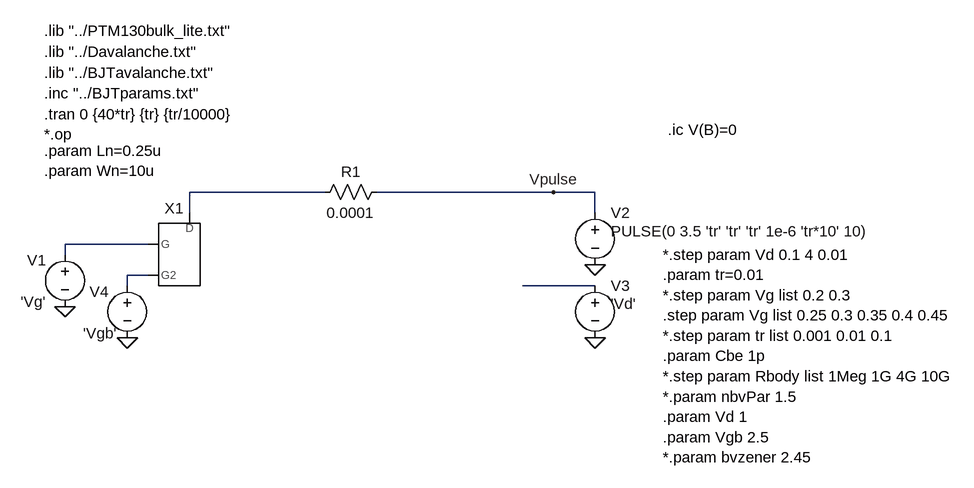
[diagram p0: schematic SubC_SimpleTest.asc]
SubC_SimpleTest.asc, the LTspice schematic file:
Version 4
SHEET 1 2588 680
WIRE 608 48 400 48
WIRE 960 48 688 48
WIRE 1024 48 960 48
WIRE 400 80 400 48
WIRE 1024 80 1024 48
WIRE 336 128 208 128
WIRE 208 144 208 128
WIRE 336 176 304 176
WIRE 304 192 304 176
WIRE 1024 192 912 192
FLAG 208 224 0
FLAG 960 48 Vpulse
FLAG 1024 272 0
FLAG 1024 160 0
FLAG 304 272 0
SYMBOL voltage 208 128 R0
WINDOW 123 0 0 Left 0
WINDOW 39 0 0 Left 0
WINDOW 0 -58 25 Left 2
WINDOW 3 -68 89 Left 2
SYMATTR InstName V1
SYMATTR Value 'Vg'
SYMBOL voltage 1024 64 R0
WINDOW 3 24 44 Left 2
WINDOW 123 0 0 Left 0
WINDOW 39 0 0 Left 0
SYMATTR Value PULSE(0 3.5 'tr' 'tr' 'tr' 1e-6 'tr*10' 10)
SYMATTR InstName V2
SYMBOL voltage 1024 176 R0
WINDOW 3 24 44 Left 2
WINDOW 123 0 0 Left 0
WINDOW 39 0 0 Left 0
SYMATTR Value 'Vd'
SYMATTR InstName V3
SYMBOL NeuronSubCirc 368 128 R0
WINDOW 0 8 -40 Bottom 2
SYMATTR InstName X1
SYMBOL res 704 32 R90
WINDOW 0 0 56 VBottom 2
WINDOW 3 32 56 VTop 2
SYMATTR InstName R1
SYMATTR Value 0.0001
SYMBOL voltage 304 176 R0
WINDOW 123 0 0 Left 0
WINDOW 39 0 0 Left 0
WINDOW 0 -58 25 Left 2
WINDOW 3 -68 89 Left 2
SYMATTR InstName V4
SYMATTR Value 'Vgb'
TEXT 176 -200 Left 2 !.lib "../PTM130bulk_lite.txt"
TEXT 176 -72 Left 2 !.tran 0 {40*tr} {tr} {tr/10000}\n*.op
TEXT 176 -16 Left 2 !.param Ln=0.25u\n.param Wn=10u
TEXT 1128 144 Left 2 !*.step param Vd 0.1 4 0.01\n.param tr=0.01\n*.step param Vg list 0.2 0.3\n.step param Vg list 0.25 0.3 0.35 0.4 0.45\n*.step param tr list 0.001 0.01 0.1\n.param Cbe 1p\n*.step param Rbody list 1Meg 1G 4G 10G\n*.param nbvPar 1.5 \n.param Vd 1\n.param Vgb 2.5\n*.param bvzener 2.45
TEXT 176 -168 Left 2 !.lib "../Davalanche.txt"
TEXT 176 -104 Left 2 !.inc "../BJTparams.txt"
TEXT 176 -136 Left 2 !.lib "../BJTavalanche.txt"
TEXT 1136 -48 Left 2 !.ic V(B)=0

The netlist it stands for:
* SubC_SimpleTest.asc
V1 N002 0 'Vg'
V2 Vpulse 0 PULSE(0 3.5 'tr' 'tr' 'tr' 1e-6 'tr*10' 10)
V3 N004 0 'Vd'
XX1 N001 N002 N003 NeuronSubCirc  ; pins D G G2
R1 Vpulse N001 0.0001
V4 N003 0 'Vgb'
.lib "../PTM130bulk_lite.txt"
.tran 0 {40*tr} {tr} {tr/10000}
*.op
.param Ln=0.25u
.param Wn=10u
*.step param Vd 0.1 4 0.01
.param tr=0.01
*.step param Vg list 0.2 0.3
.step param Vg list 0.25 0.3 0.35 0.4 0.45
*.step param tr list 0.001 0.01 0.1
.param Cbe 1p
*.step param Rbody list 1Meg 1G 4G 10G
*.param nbvPar 1.5
.param Vd 1
.param Vgb 2.5
*.param bvzener 2.45
.lib "../Davalanche.txt"
.inc "../BJTparams.txt"
.lib "../BJTavalanche.txt"
.ic V(B)=0
.backanno
.end